# Altium project DUT_ESP32-D0WD-V3.PrjPcb
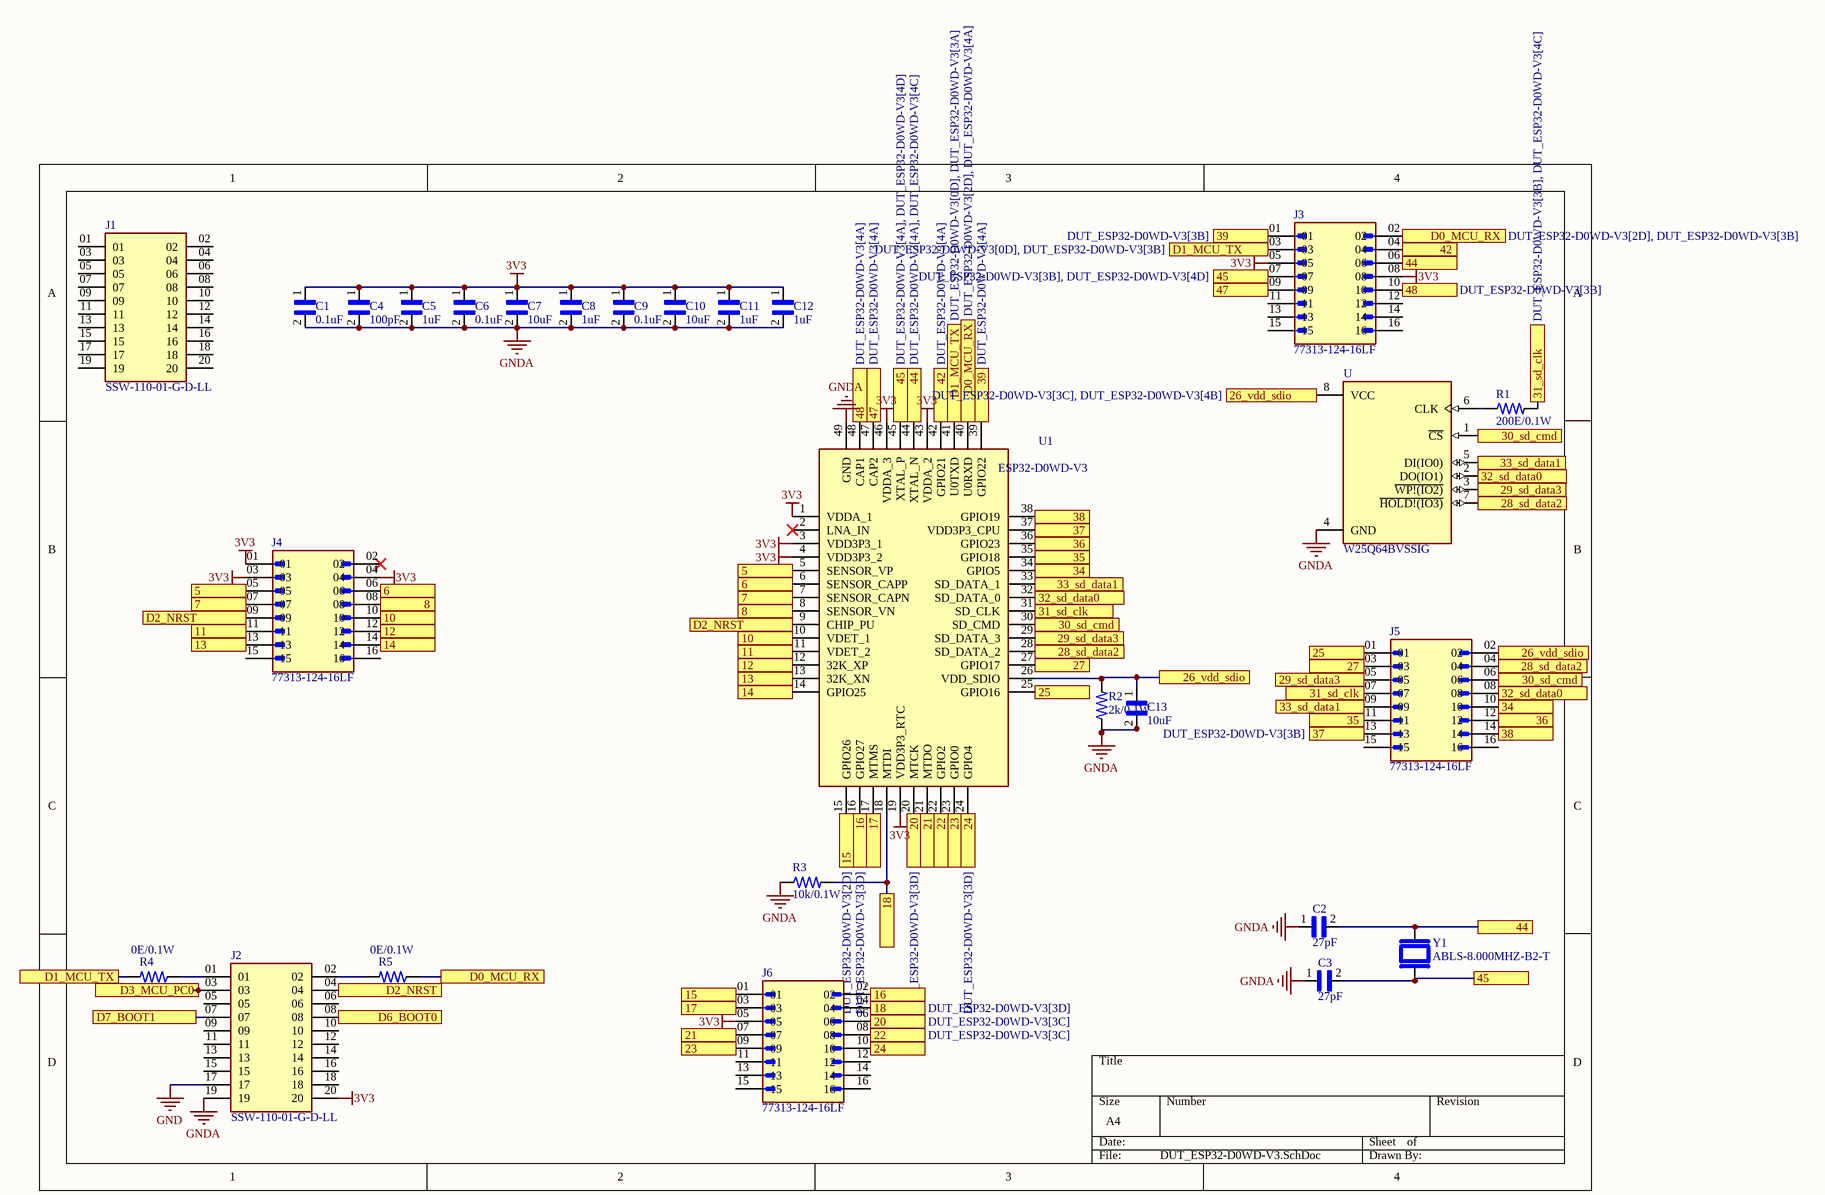
[diagram p0: DUT_ESP32-D0WD-V3.SchDoc]
1 sheet, 27 parts. Net scope: flat (ports and power ports of the same name join across sheets).
Board file: DUT_ESP32-D0WD-V3.PcbDoc

## Sheet DUT_ESP32-D0WD-V3.SchDoc
size A4; SheetNumber: 1; SheetTotal: 1

### Parts
C1  0.1uF  [CAPC1608X90]
C2  27pF  [CAPC1608X90]
C3  27pF  [CAPC1608X90]
C4  100pF  [CAPC1608X90]
C5  1uF  [CAPC1608X90]
C6  0.1uF  [CAPC1608X90]
C7  10uF  [CAPC1608X90]
C8  1uF  [CAPC1608X90]
C9  0.1uF  [CAPC1608X90]
C10  10uF  [CAPC1608X90]
C11  1uF  [CAPC1608X90]
C12  1uF  [CAPC1608X90]
C13  10uF  [CAPC1608X90]
J1  SSW-110-01-G-D-LL  [SAMTEC_SSW-110-01-G-D-LL]
J2  SSW-110-01-G-D-LL  [SAMTEC_SSW-110-01-G-D-LL]
J3  77313-124-16LF  [AMPHENOL_77313-124-16LF]
J4  77313-124-16LF  [AMPHENOL_77313-124-16LF]
J5  77313-124-16LF  [AMPHENOL_77313-124-16LF]
J6  77313-124-16LF  [AMPHENOL_77313-124-16LF]
R1  200E/0.1W  [RESC1608X50N]
R2  2k/0.1W  [RESC1608X50N]
R3  10k/0.1W  [RESC1608X50N]
R4  0E/0.1W  [RESC1608X50N]
R5  0E/0.1W  [RESC1608X50N]
U  W25Q64BVSSIG  [SOIC127P790X216-8N]
U1  ESP32-D0WD-V3  [QFN35P500X500X90-49N-D]
Y1  ABLS-8.000MHZ-B2-T  [XTAL_ABLS-8.000MHZ-B2-T]

### Ports
5 (see DUT_ESP32-D0WD-V3[1B]), 5 (see DUT_ESP32-D0WD-V3[2B]), 6 (see DUT_ESP32-D0WD-V3[1B]), 6 (see DUT_ESP32-D0WD-V3[2B]), 7 (see DUT_ESP32-D0WD-V3[1B]), 7 (see DUT_ESP32-D0WD-V3[2B]), 8 (see DUT_ESP32-D0WD-V3[1B]), 8 (see DUT_ESP32-D0WD-V3[2B]), 10 (see DUT_ESP32-D0WD-V3[1B]), 10 (see DUT_ESP32-D0WD-V3[2B]), 11 (see DUT_ESP32-D0WD-V3[1B]), 11 (see DUT_ESP32-D0WD-V3[2B]), 12 (see DUT_ESP32-D0WD-V3[1B]), 12 (see DUT_ESP32-D0WD-V3[2B]), 13 (see DUT_ESP32-D0WD-V3[1B]), 13 (see DUT_ESP32-D0WD-V3[2C]), 14 (see DUT_ESP32-D0WD-V3[1B]), 14 (see DUT_ESP32-D0WD-V3[2C]), 15 (see DUT_ESP32-D0WD-V3[2D]), 15 (see DUT_ESP32-D0WD-V3[3C]), 16 (see DUT_ESP32-D0WD-V3[3C]), 16 (see DUT_ESP32-D0WD-V3[3D]), 17 (see DUT_ESP32-D0WD-V3[2D]), 17 (see DUT_ESP32-D0WD-V3[3C]), 18 (see DUT_ESP32-D0WD-V3[3D]), 20 (see DUT_ESP32-D0WD-V3[3C]), 20 (see DUT_ESP32-D0WD-V3[3D]), 21 (see DUT_ESP32-D0WD-V3[2D]), 21 (see DUT_ESP32-D0WD-V3[3C]), 22 (see DUT_ESP32-D0WD-V3[3C]), 22 (see DUT_ESP32-D0WD-V3[3D]), 23 (see DUT_ESP32-D0WD-V3[2D]), 23 (see DUT_ESP32-D0WD-V3[3C]), 24 (see DUT_ESP32-D0WD-V3[3C]), 24 (see DUT_ESP32-D0WD-V3[3D]), 25 (see DUT_ESP32-D0WD-V3[3C]), 25 (see DUT_ESP32-D0WD-V3[4B]), 26_vdd_sdio (see DUT_ESP32-D0WD-V3[3C], DUT_ESP32-D0WD-V3[4A]), 26_vdd_sdio (see DUT_ESP32-D0WD-V3[3C], DUT_ESP32-D0WD-V3[4B]), 26_vdd_sdio (see DUT_ESP32-D0WD-V3[4A], DUT_ESP32-D0WD-V3[4B]), 27 (see DUT_ESP32-D0WD-V3[3B]), 27 (see DUT_ESP32-D0WD-V3[4B]), 28_sd_data2 (see DUT_ESP32-D0WD-V3[3B], DUT_ESP32-D0WD-V3[4B]), 28_sd_data2 (see DUT_ESP32-D0WD-V3[4B]), 29_sd_data3 (see DUT_ESP32-D0WD-V3[3B], DUT_ESP32-D0WD-V3[4B]), 29_sd_data3 (see DUT_ESP32-D0WD-V3[3B], DUT_ESP32-D0WD-V3[4C]), 29_sd_data3 (see DUT_ESP32-D0WD-V3[4B], DUT_ESP32-D0WD-V3[4C]), 30_sd_cmd (see DUT_ESP32-D0WD-V3[3B], DUT_ESP32-D0WD-V3[4B]), 30_sd_cmd (see DUT_ESP32-D0WD-V3[3B], DUT_ESP32-D0WD-V3[4C]), 30_sd_cmd (see DUT_ESP32-D0WD-V3[4B], DUT_ESP32-D0WD-V3[4C]), 31_sd_clk (see DUT_ESP32-D0WD-V3[3B], DUT_ESP32-D0WD-V3[4A]), 31_sd_clk (see DUT_ESP32-D0WD-V3[3B], DUT_ESP32-D0WD-V3[4C]), 31_sd_clk (see DUT_ESP32-D0WD-V3[4A], DUT_ESP32-D0WD-V3[4C]), 32_sd_data0 (see DUT_ESP32-D0WD-V3[3B], DUT_ESP32-D0WD-V3[4B]), 32_sd_data0 (see DUT_ESP32-D0WD-V3[3B], DUT_ESP32-D0WD-V3[4C]), 32_sd_data0 (see DUT_ESP32-D0WD-V3[4B], DUT_ESP32-D0WD-V3[4C]), 33_sd_data1 (see DUT_ESP32-D0WD-V3[3B], DUT_ESP32-D0WD-V3[4B]), 33_sd_data1 (see DUT_ESP32-D0WD-V3[3B], DUT_ESP32-D0WD-V3[4C]), 33_sd_data1 (see DUT_ESP32-D0WD-V3[4B], DUT_ESP32-D0WD-V3[4C]), 34 (see DUT_ESP32-D0WD-V3[3B]), 34 (see DUT_ESP32-D0WD-V3[4C]), 35 (see DUT_ESP32-D0WD-V3[3B]), 35 (see DUT_ESP32-D0WD-V3[4C]), 36 (see DUT_ESP32-D0WD-V3[3B]), 36 (see DUT_ESP32-D0WD-V3[4C]), 37 (see DUT_ESP32-D0WD-V3[3B]), 37 (see DUT_ESP32-D0WD-V3[4C]), 38 (see DUT_ESP32-D0WD-V3[3B]), 38 (see DUT_ESP32-D0WD-V3[4C]), 39 (see DUT_ESP32-D0WD-V3[3B]), 39 (see DUT_ESP32-D0WD-V3[4A]), 42 (see DUT_ESP32-D0WD-V3[3B]), 42 (see DUT_ESP32-D0WD-V3[4A]), 44 (see DUT_ESP32-D0WD-V3[3B], DUT_ESP32-D0WD-V3[4A]), 44 (see DUT_ESP32-D0WD-V3[3B], DUT_ESP32-D0WD-V3[4C]), 44 (see DUT_ESP32-D0WD-V3[4A], DUT_ESP32-D0WD-V3[4C]), 45 (see DUT_ESP32-D0WD-V3[3B], DUT_ESP32-D0WD-V3[4A]), 45 (see DUT_ESP32-D0WD-V3[3B], DUT_ESP32-D0WD-V3[4D]), 45 (see DUT_ESP32-D0WD-V3[4A], DUT_ESP32-D0WD-V3[4D]), 47 (see DUT_ESP32-D0WD-V3[3B]), 47 (see DUT_ESP32-D0WD-V3[4A]), 48 (see DUT_ESP32-D0WD-V3[3B]), 48 (see DUT_ESP32-D0WD-V3[4A]), D0_MCU_RX (see DUT_ESP32-D0WD-V3[2D], DUT_ESP32-D0WD-V3[3B]), D0_MCU_RX (see DUT_ESP32-D0WD-V3[2D], DUT_ESP32-D0WD-V3[4A]), D0_MCU_RX (see DUT_ESP32-D0WD-V3[3B], DUT_ESP32-D0WD-V3[4A]), D1_MCU_TX (see DUT_ESP32-D0WD-V3[0D], DUT_ESP32-D0WD-V3[3A]), D1_MCU_TX (see DUT_ESP32-D0WD-V3[0D], DUT_ESP32-D0WD-V3[3B]), D1_MCU_TX (see DUT_ESP32-D0WD-V3[3A], DUT_ESP32-D0WD-V3[3B]), D2_NRST (see DUT_ESP32-D0WD-V3[1B], DUT_ESP32-D0WD-V3[1D]), D2_NRST (see DUT_ESP32-D0WD-V3[1B], DUT_ESP32-D0WD-V3[2B]), D2_NRST (see DUT_ESP32-D0WD-V3[1D], DUT_ESP32-D0WD-V3[2B]), D3_MCU_PC0, D6_BOOT0, D7_BOOT1

### Nets
3V3: C1.1 C4.1 C5.1 C6.1 C7.1 C8.1 C9.1 C10.1 C11.1 C12.1 J2.20 J3.05 J3.08 J4.01 J4.03 J4.04 J6.05 U1.1(VDDA_1) U1.3(VDD3P3_1) U1.4(VDD3P3_2) U1.19(VDD3P3_RTC) U1.43(VDDA_2) U1.46(VDDA_3)
GND: J2.17
GNDA: C1.2 C2.1 C3.1 C4.2 C5.2 C6.2 C7.2 C8.2 C9.2 C10.2 C11.2 C12.2 C13.2 J2.19 R2.1 R3.1 U.4(GND) U1.49(GND)
NetC2_2: C2.2 J3.06 U1.44(XTAL_N) Y1.1 ; port 44
NetC3_2: C3.2 J3.07 U1.45(XTAL_P) Y1.2 ; port 45
NetC13_1: C13.1 J5.02 R2.2 U.8(VCC) U1.26(VDD_SDIO) ; port 26_vdd_sdio
NetJ2_01: J2.01 R4.1
NetJ2_02: J2.02 R5.2
NetJ2_03: J2.03 ; port D3_MCU_PC0
NetJ2_04: J2.04 J4.09 U1.9(CHIP_PU) ; port D2_NRST
NetJ2_07: J2.07 ; port D7_BOOT1
NetJ2_08: J2.08 ; port D6_BOOT0
NetJ3_01: J3.01 U1.39(GPIO22) ; port 39
NetJ3_02: J3.02 R5.1 U1.40(U0RXD) ; port D0_MCU_RX
NetJ3_03: J3.03 R4.2 U1.41(U0TXD) ; port D1_MCU_TX
NetJ3_04: J3.04 U1.42(GPIO21) ; port 42
NetJ3_09: J3.09 U1.47(CAP2) ; port 47
NetJ3_10: J3.10 U1.48(CAP1) ; port 48
NetJ4_05: J4.05 U1.5(SENSOR_VP) ; port 5
NetJ4_06: J4.06 U1.6(SENSOR_CAPP) ; port 6
NetJ4_07: J4.07 U1.7(SENSOR_CAPN) ; port 7
NetJ4_08: J4.08 U1.8(SENSOR_VN) ; port 8
NetJ4_10: J4.10 U1.10(VDET_1) ; port 10
NetJ4_11: J4.11 U1.11(VDET_2) ; port 11
NetJ4_12: J4.12 U1.12(32K_XP) ; port 12
NetJ4_13: J4.13 U1.13(32K_XN) ; port 13
NetJ4_14: J4.14 U1.14(GPIO25) ; port 14
NetJ5_01: J5.01 U1.25(GPIO16) ; port 25
NetJ5_03: J5.03 U1.27(GPIO17) ; port 27
NetJ5_04: J5.04 U.7(~{HOLD!(IO3)}) U1.28(SD_DATA_2) ; port 28_sd_data2
NetJ5_05: J5.05 U.3(~{WP!(IO2)}) U1.29(SD_DATA_3) ; port 29_sd_data3
NetJ5_06: J5.06 U.1(~{CS}) U1.30(SD_CMD) ; port 30_sd_cmd
NetJ5_07: J5.07 R1.2 U1.31(SD_CLK) ; port 31_sd_clk
NetJ5_08: J5.08 U.2(DO(IO1)) U1.32(SD_DATA_0) ; port 32_sd_data0
NetJ5_09: J5.09 U.5(DI(IO0)) U1.33(SD_DATA_1) ; port 33_sd_data1
NetJ5_10: J5.10 U1.34(GPIO5) ; port 34
NetJ5_11: J5.11 U1.35(GPIO18) ; port 35
NetJ5_12: J5.12 U1.36(GPIO23) ; port 36
NetJ5_13: J5.13 U1.37(VDD3P3_CPU) ; port 37
NetJ5_14: J5.14 U1.38(GPIO19) ; port 38
NetJ6_01: J6.01 U1.15(GPIO26) ; port 15
NetJ6_02: J6.02 U1.16(GPIO27) ; port 16
NetJ6_03: J6.03 U1.17(MTMS) ; port 17
NetJ6_04: J6.04 R3.2 U1.18(MTDI) ; port 18
NetJ6_06: J6.06 U1.20(MTCK) ; port 20
NetJ6_07: J6.07 U1.21(MTDO) ; port 21
NetJ6_08: J6.08 U1.22(GPIO2) ; port 22
NetJ6_09: J6.09 U1.23(GPIO0) ; port 23
NetJ6_10: J6.10 U1.24(GPIO4) ; port 24
NetR1_1: R1.1 U.6(CLK)

Not connected (* = marked no-connect by the designer): J1 01 02 03 04 05 06 07 08 09 10 11 12 13 14 15 16 17 18 19 20; J2 05 06 09 10 11 12 13 14 15 16 18; J3 11 12 13 14 15 16; J4 02* 15 16; J5 15 16; J6 11 12 13 14 15 16; U1 2(LNA_IN)*

### Library data of the parts
C1 C4-C13 = CC0603MRX5R7BB106: CAP CER 10UF 16V X5R 0603; Package: None; Price: None; Value: *; MP: CC0603MRX5R7BB106; Availability: Unavailable
C2 C3 = CC0603MRX5R7BB106: 0603; Package: None; Price: None; Value: *; MP: CC0603MRX5R7BB106; Availability: Unavailable
J1 J2 = SSW-110-01-G-D-LL: MF: Samtec Inc.; Value: *; Availability: Unavailable; Package: None; Price: None; MP: SSW-110-01-G-D-LL
J3-J6 = 77313-124-16LF: BergStikÂ®, Board to Board connector, Unshrouded Header, 2.54 mm Pitch, Vertical, Double Row,Through Hole, 16 Positions; MF: Amphenol ICC (FCI); SnapEDA_Link: https://www.snapeda.com/parts/77313-124-16LF/Amphenol+FCI/view-part/?ref=snap; Package: None; Value: *; MP: 77313-124-16LF; Check_prices: https://www.snapeda.com/parts/77313-124-16LF/Amphenol+FCI/view-part/?ref=eda
R1-R5 = 3-1879460-5: RES 0.27 OHM 1% 1/10W 0603; Power_Rating: .1 W; Resistance: 27; MF: TE Connectivity; SnapEDA_Link: https://www.snapeda.com/parts/3-1879460-5/TE+Connectivity/view-part/?ref=snap; MP: 3-1879460-5; Package: 0603; Check_prices: https://www.snapeda.com/parts/3-1879460-5/TE+Connectivity/view-part/?ref=eda; EU_RoHS_Compliance: Compliant with Exemptions; Price: None; Tolerance: 1%; Availability: In Stock; Value: *
U = W25Q64BVSSIG: FLASH - NOR Memory IC 64Mb _8M x 8_ SPI 80MHz 8-SOIC; MF: Winbond Electronics; MP: W25Q64BVSSIG; Package: SOIC-8 Winbond; Price: None; Availability: Unavailable; Value: *; SnapEDA_Link: https://www.snapeda.com/parts/W25Q64BVSSIG/Winbond%20Electronics/view-part/261027/?ref=snap
U1 = ESP32-D0WD-V3: WiFi Development Tools (802.11) SMD IC WiFi Dual Core BT Combo; Manufacturer_Name: Espressif Systems; Geometry.Height: 0.9mm; Mouser Part Number: 356-ESP32-D0WD-V3; Mouser Price/Stock: https://www.mouser.co.uk/ProductDetail/Espressif-Systems/ESP32-D0WD-V3?qs=GBLSl2AkirsI7kXw8ZPing%3D%3D; Manufacturer_Part_Number: ESP32-D0WD-V3; Datasheet Link: https://www.espressif.com/sites/default/files/documentation/esp32_datasheet_en.pdf
Y1 = ABLS-8.000MHZ-B2-T: HC/49US (AT49) SMD LOW PROFILE CRYSTAL; MF: Abracon LLC; Availability: In Stock; Purchase-URL: https://pricing.snapeda.com/search/part/ABLS-8.000MHZ-B2-T/?ref=eda; Package: HC49/US Abracon; MP: ABLS-8.000MHZ-B2-T; Value: *; Check_prices: https://www.snapeda.com/parts/ABLS-8.000MHZ-B2-T/Abracon+LLC/view-part/?ref=eda; SnapEDA_Link: https://www.snapeda.com/parts/ABLS-8.000MHZ-B2-T/Abracon+LLC/view-part/?ref=snap; Price: None